# EAGLE design Gamecube3 (EAGLE 6.1)
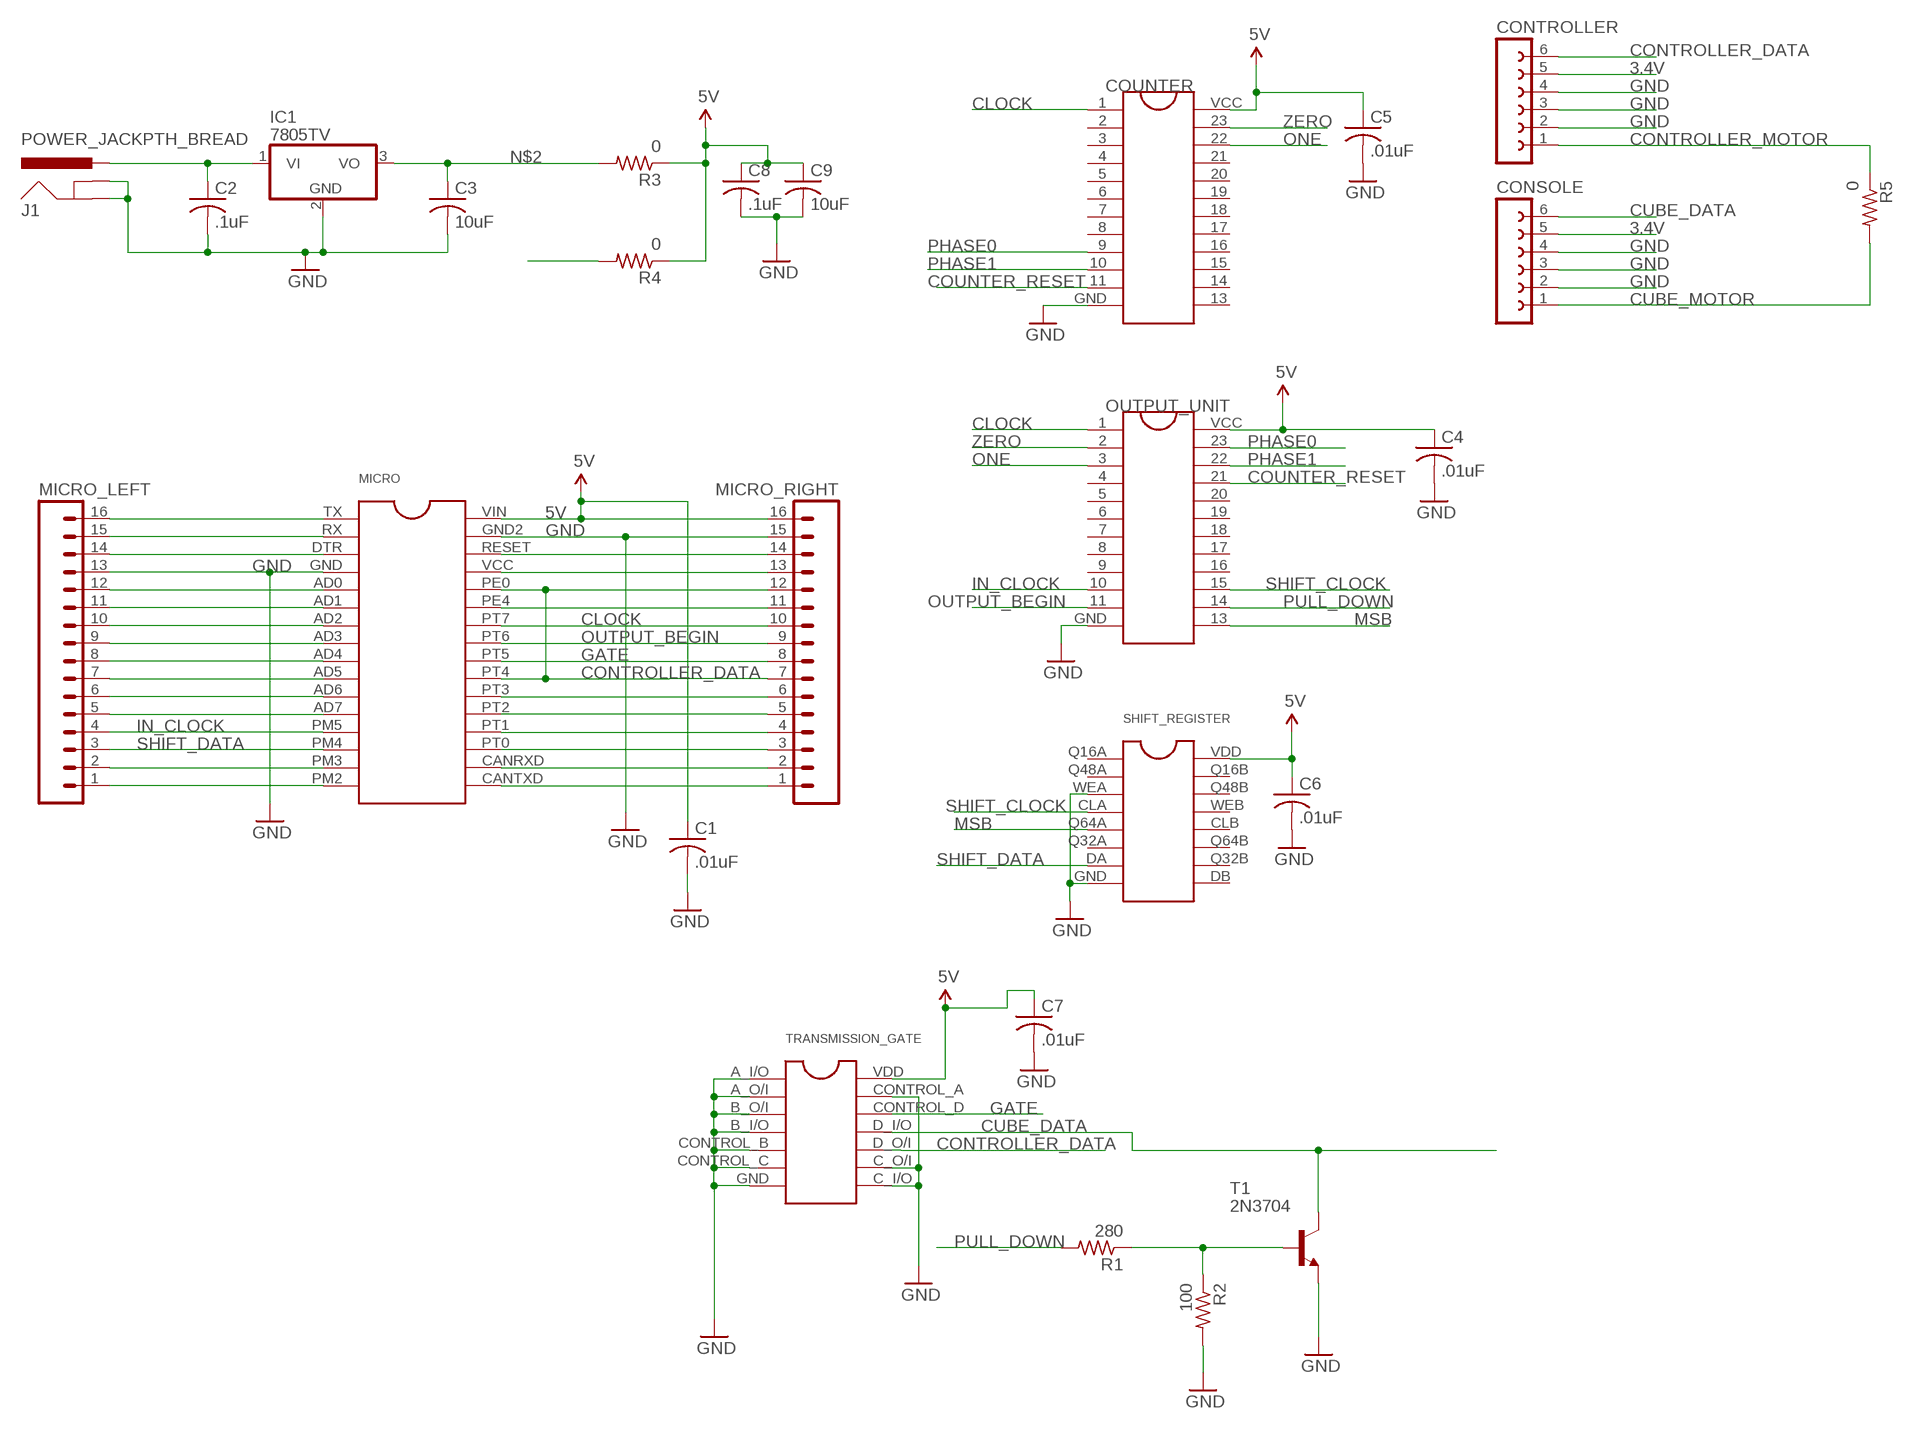
[diagram p0: schematic, sheet 1]

## Parts
C1  .01uF  C-USC0805  [C0805]
C2  .1uF  C-USC0805  [C0805]
C3  10uF  C-USC1206  [C1206]
C4  .01uF  C-USC0805  [C0805]
C5  .01uF  C-USC0805  [C0805]
C6  .01uF  C-USC0805  [C0805]
C7  .01uF  C-USC0805  [C0805]
C8  .1uF  C-USC0805  [C0805]
C9  10uF  C-USC1206  [C1206]
CONSOLE  FE06-1  [FE06]
CONTROLLER  FE06-1  [FE06]
COUNTER  GAL22V10  [24-PIN-DIP]
IC1  7805TV  [TO220V]
J1  POWER_JACKPTH_BREAD  [POWER_JACK_PTH_BREAD]
MICRO  9S12C32  [9S12-32PIN-DIP]
MICRO_LEFT  M16  [16P]
MICRO_RIGHT  M16  [16P]
OUTPUT_UNIT  GAL22V10  [24-PIN-DIP]
R1  280  R-US_0204/7  [0204/7]
R2  100  R-US_0204/7  [0204/7]
R3  0  R-US_0204/7  [0204/7]
R4  0  R-US_0204/7  [0204/7]
R5  0  R-US_0204/7  [0204/7]
SHIFT_REGISTER  CD4517B  [CD4517B]
T1  2N3704  [TO92]
TRANSMISSION_GATE  CD4066B  [CD4066B]

## Nets
3.4V: CONSOLE.5 CONTROLLER.5
5V: C1.1 C4.1 C5.1 C6.1 C7.1 C8.1 C9.1 COUNTER.VCC MICRO.VIN MICRO_RIGHT.16 OUTPUT_UNIT.VCC R3.1 R4.1 SHIFT_REGISTER.VDD TRANSMISSION_GATE.VDD
CLOCK: COUNTER.1 MICRO.PT7 MICRO_RIGHT.10 OUTPUT_UNIT.1
CONTROLLER_DATA: CONTROLLER.6 MICRO.PE0 MICRO.PT4 MICRO_RIGHT.7 MICRO_RIGHT.12 TRANSMISSION_GATE.D_O/I
CONTROLLER_MOTOR: CONTROLLER.1 R5.1
COUNTER_RESET: COUNTER.11 OUTPUT_UNIT.21
CUBE_DATA: CONSOLE.6 T1.2(C) TRANSMISSION_GATE.D_I/O
CUBE_MOTOR: CONSOLE.1 R4.2 R5.2
GATE: MICRO.PT5 MICRO_RIGHT.8 TRANSMISSION_GATE.CONTROL_D
GND: C1.2 C2.2 C3.2 C4.2 C5.2 C6.2 C7.2 C8.2 C9.2 CONSOLE.2 CONSOLE.3 CONSOLE.4 CONTROLLER.2 CONTROLLER.3 CONTROLLER.4 COUNTER.GND IC1.2(GND) J1.GND J1.GNDBREAK MICRO.GND MICRO.GND2 MICRO_LEFT.13 MICRO_RIGHT.15 OUTPUT_UNIT.GND R2.2 SHIFT_REGISTER.GND SHIFT_REGISTER.WEA T1.3(E) TRANSMISSION_GATE.A_I/O TRANSMISSION_GATE.A_O/I TRANSMISSION_GATE.B_I/O TRANSMISSION_GATE.B_O/I TRANSMISSION_GATE.C_I/O TRANSMISSION_GATE.C_O/I TRANSMISSION_GATE.CONTROL_A TRANSMISSION_GATE.CONTROL_B TRANSMISSION_GATE.CONTROL_C TRANSMISSION_GATE.GND
IN_CLOCK: MICRO.PM5 MICRO_LEFT.4 OUTPUT_UNIT.10
MSB: OUTPUT_UNIT.13 SHIFT_REGISTER.Q64A
N$1: C2.1 IC1.1(VI) J1.PWR
N$2: C3.1 IC1.3(VO) R3.2
N$3: R1.1 R2.1 T1.1(B)
N$4: MICRO.CANTXD MICRO_RIGHT.1
N$5: MICRO.PM2 MICRO_LEFT.1
N$6: MICRO.PM3 MICRO_LEFT.2
N$7: MICRO.AD7 MICRO_LEFT.5
N$8: MICRO.AD6 MICRO_LEFT.6
N$9: MICRO.AD5 MICRO_LEFT.7
N$10: MICRO.AD4 MICRO_LEFT.8
N$11: MICRO.AD3 MICRO_LEFT.9
N$12: MICRO.AD2 MICRO_LEFT.10
N$13: MICRO.AD1 MICRO_LEFT.11
N$14: MICRO.AD0 MICRO_LEFT.12
N$15: MICRO.DTR MICRO_LEFT.14
N$16: MICRO.RX MICRO_LEFT.15
N$17: MICRO.TX MICRO_LEFT.16
N$18: MICRO.CANRXD MICRO_RIGHT.2
N$19: MICRO.PT0 MICRO_RIGHT.3
N$20: MICRO.PT1 MICRO_RIGHT.4
N$21: MICRO.PT2 MICRO_RIGHT.5
N$22: MICRO.PT3 MICRO_RIGHT.6
N$23: MICRO.PE4 MICRO_RIGHT.11
N$24: MICRO.VCC MICRO_RIGHT.13
N$25: MICRO.RESET MICRO_RIGHT.14
ONE: COUNTER.22 OUTPUT_UNIT.3
OUTPUT_BEGIN: MICRO.PT6 MICRO_RIGHT.9 OUTPUT_UNIT.11
PHASE0: COUNTER.9 OUTPUT_UNIT.23
PHASE1: COUNTER.10 OUTPUT_UNIT.22
PULL_DOWN: OUTPUT_UNIT.14 R1.2
SHIFT_CLOCK: OUTPUT_UNIT.15 SHIFT_REGISTER.CLA
SHIFT_DATA: MICRO.PM4 MICRO_LEFT.3 SHIFT_REGISTER.DA
ZERO: COUNTER.23 OUTPUT_UNIT.2
Unconnected: COUNTER.2 COUNTER.3 COUNTER.4 COUNTER.5 COUNTER.6 COUNTER.7 COUNTER.8 COUNTER.13 COUNTER.14 COUNTER.15 COUNTER.16 COUNTER.17 COUNTER.18 COUNTER.19 COUNTER.20 COUNTER.21 OUTPUT_UNIT.4 OUTPUT_UNIT.5 OUTPUT_UNIT.6 OUTPUT_UNIT.7 OUTPUT_UNIT.8 OUTPUT_UNIT.9 OUTPUT_UNIT.16 OUTPUT_UNIT.17 OUTPUT_UNIT.18 OUTPUT_UNIT.19 OUTPUT_UNIT.20 SHIFT_REGISTER.CLB SHIFT_REGISTER.DB SHIFT_REGISTER.Q16A SHIFT_REGISTER.Q16B SHIFT_REGISTER.Q32A SHIFT_REGISTER.Q32B SHIFT_REGISTER.Q48A SHIFT_REGISTER.Q48B SHIFT_REGISTER.Q64B SHIFT_REGISTER.WEB

## Library data of the parts
C1-C9 = rcl:C-US: CAPACITOR, American symbol
CONSOLE CONTROLLER = con-lsta:FE06-1: FEMALE HEADER; OC_FARNELL: unknown; OC_NEWARK: unknown
COUNTER OUTPUT_UNIT = GameCube:GAL22V10
IC1 = linear:78*: Positive VOLTAGE REGULATOR Source: http://cache.national.com/ds/LM/LM78L05.pdf http://www.fairchildsemi.com/ds/LM/LM7805.pdf
J1 = SparkFun-Connectors:POWER_JACK: Power Jack This is the standard 5.5mm barrel jack for power. The PTH is the most common, proven, reliable, footprint. The Slot footprint only works if the mill layer is transmitted to the PCB fab house so be warned. Mating wall wart : TOL-00298 (and others); PROD_ID: PRT-10811
MICRO = GameCube:9S12C32
MICRO_LEFT MICRO_RIGHT = con-amp-quick:M16: AMP QUICK CONNECTOR; OC_FARNELL: unknown; OC_NEWARK: unknown
R1-R5 = rcl:R-US_: RESISTOR, American symbol
SHIFT_REGISTER = GameCube:CD4517B
T1 = transistor:2N3704: NPN TRANSISTOR
TRANSMISSION_GATE = GameCube:CD4066B

## Net classes
0 default: width 0.254 mm, clearance 0.254 mm

## Board
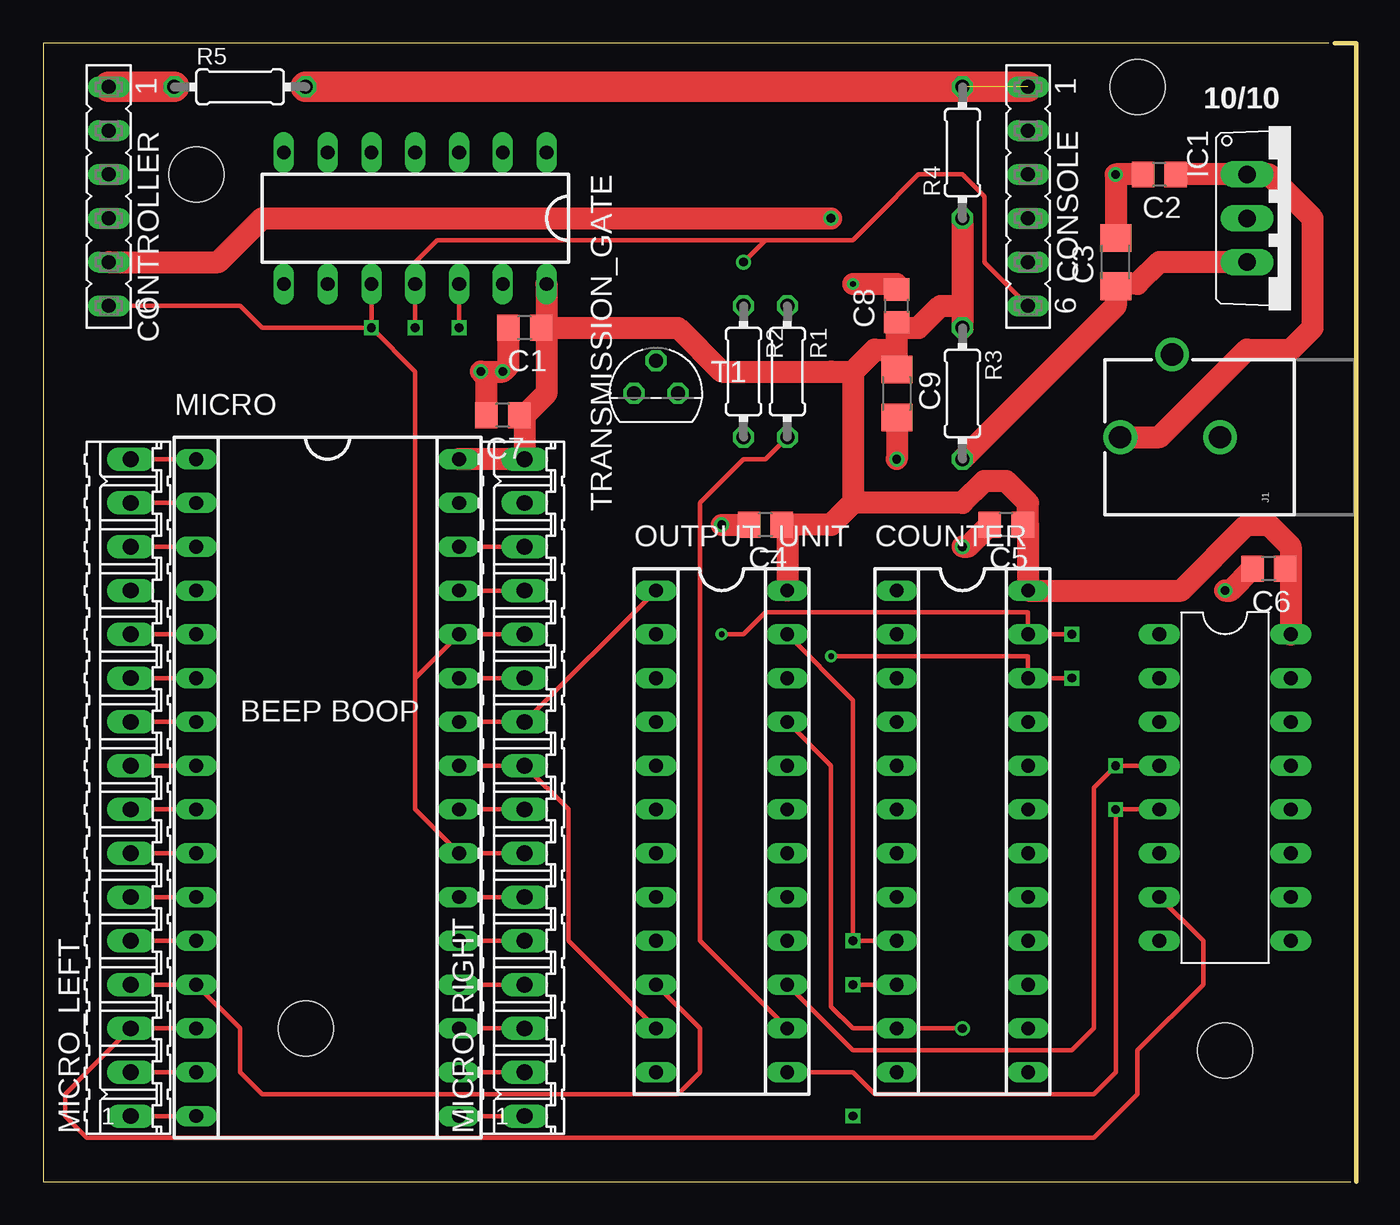
[diagram p1: board, top side]
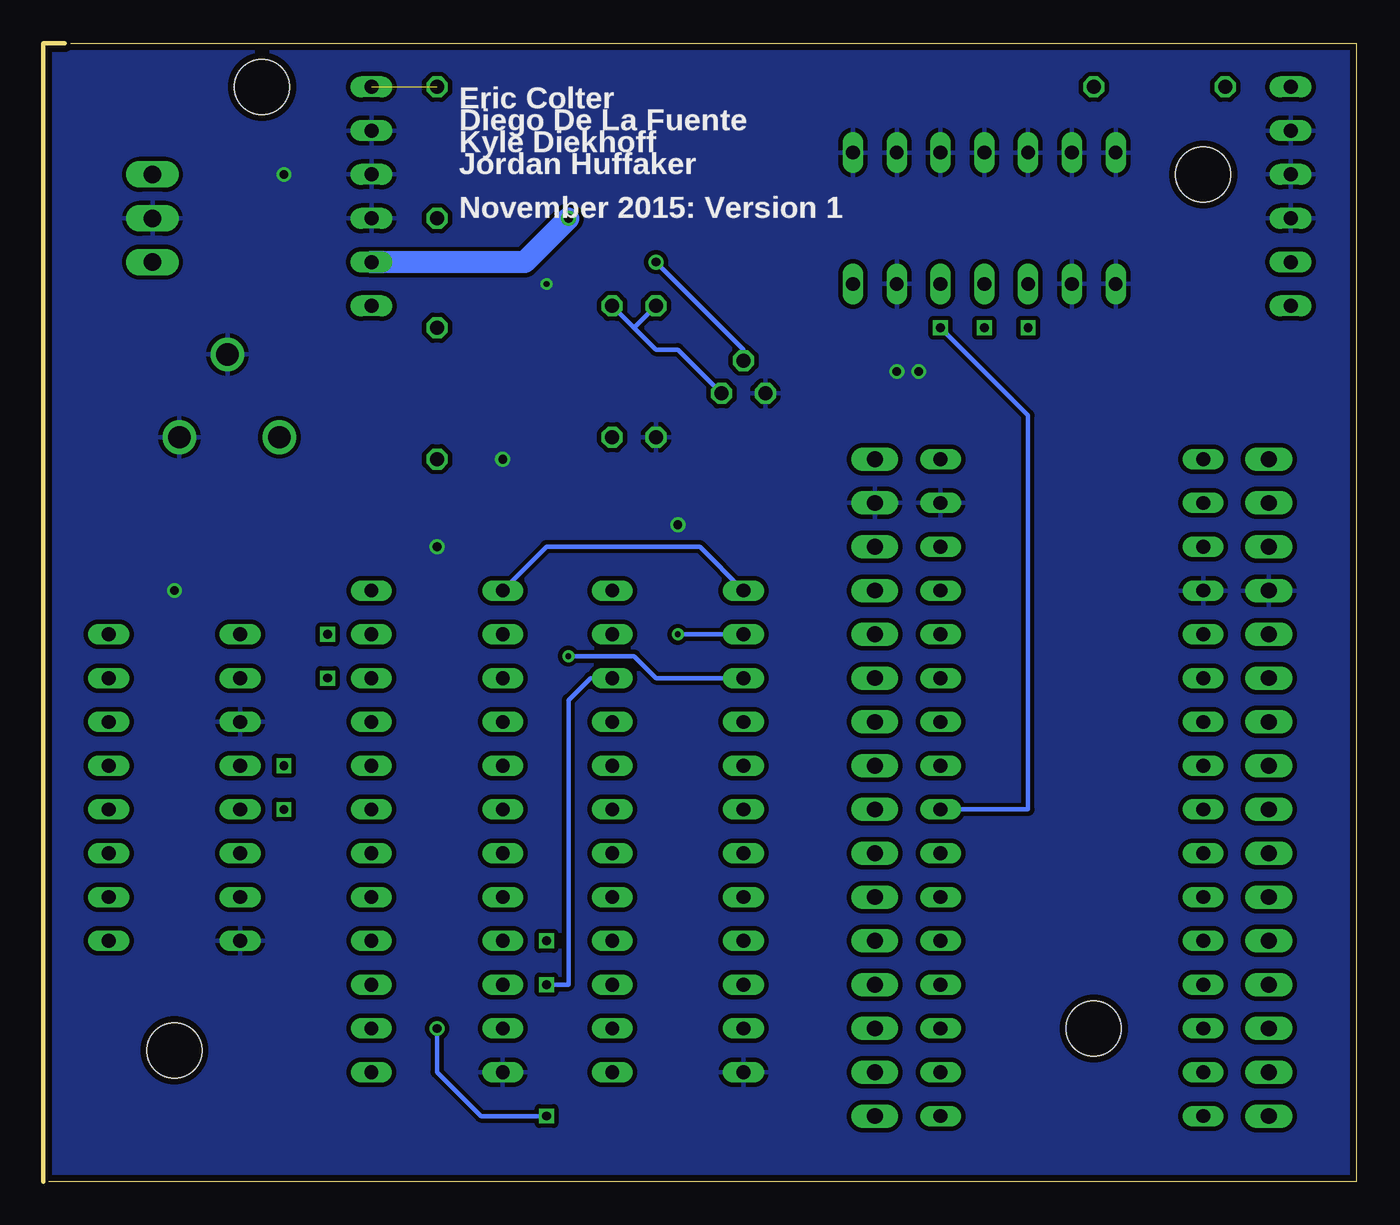
[diagram p2: board, bottom side, seen from below]

Size 76.2 x 66.04 mm. Coordinates in mm from the lower left corner, seen from the top.
Outline: 75.87,0 0,0 0,66.03 74.6,66.03
Outline: 76.2,0 76.2,66.04 74.93,66.04
Copper layers (1*16): Top 0.0356mm / dielectric 1.5011mm / Bottom 0.0356mm
Design rules: minimum track width 6mil, minimum drill 13mil, track to track 6mil, track to pad 6mil, pad to pad 6mil, via to via 6mil, smd to smd 6mil, copper to edge 15mil, drill to drill 6mil, minimum pad ring 7mil, minimum via ring 7mil, stop-mask expansion 3mil, vias tented up to drill 0mil, thermal gap 10mil
Holes 3.17 mm at 8.89,58.42 15.24,8.89 63.5,63.5 68.58,7.62

### Footprints (pad centres in the part's own frame; a part is rotated, then mirrored left to right if it is on the bottom)
C0805 = smd 1.3 x 1.5: 1 -0.95,0; 2 0.95,0
C1206 = smd 1.6 x 1.8: 1 -1.4,0; 2 1.4,0
FE06 = drill 0.813 long: 1 -6.35,0; 2 -3.81,0; 3 -1.27,0; 4 1.27,0; 5 3.81,0; 6 6.35,0
24-PIN-DIP = drill 0.8 long: 1 -3.81,13.97; 2 -3.81,11.43; 3 -3.81,8.89; 4 -3.81,6.35; 5 -3.81,3.81; 6 -3.81,1.27; 7 -3.81,-1.27; 8 -3.81,-3.81; 9 -3.81,-6.35; 10 -3.81,-8.89; 11 -3.81,-11.43; 13 3.81,-13.97; 14 3.81,-11.43; 15 3.81,-8.89; 16 3.81,-6.35; 17 3.81,-3.81; 18 3.81,-1.27; 19 3.81,1.27; 20 3.81,3.81; 21 3.81,6.35; 22 3.81,8.89; 23 3.81,11.43; GND -3.81,-13.97; VCC 3.81,13.97
TO220V = drill 1.016 long: 1 -2.54,-2.54; 2 0,-2.54; 3 2.54,-2.54
POWER_JACK_PTH_BREAD = drill 1.3: GND 0,7.9; GNDBREAK 4.8,10.7; PWR 0,13.7
9S12-32PIN-DIP = drill 0.8 long: AD0 -7.62,1.27; AD1 -7.62,-1.27; AD2 -7.62,-3.81; AD3 -7.62,-6.35; AD4 -7.62,-8.89; AD5 -7.62,-11.43; AD6 -7.62,-13.97; AD7 -7.62,-16.51; CANRXD 7.62,-24.13; CANTXD 7.62,-26.67; DTR -7.62,6.35; GND -7.62,3.81; GND2 7.62,8.89; PE0 7.62,1.27; PE4 7.62,-1.27; PM2 -7.62,-26.67; PM3 -7.62,-24.13; PM4 -7.62,-21.59; PM5 -7.62,-19.05; PT0 7.62,-21.59; PT1 7.62,-19.05; PT2 7.62,-16.51; PT3 7.62,-13.97; PT4 7.62,-11.43; PT5 7.62,-8.89; PT6 7.62,-6.35; PT7 7.62,-3.81; RESET 7.62,6.35; RX -7.62,8.89; TX -7.62,11.43; VCC 7.62,3.81; VIN 7.62,11.43
16P = drill 0.914 long: 1 -19.05,0; 2 -16.51,0; 3 -13.97,0; 4 -11.43,0; 5 -8.89,0; 6 -6.35,0; 7 -3.81,0; 8 -1.27,0; 9 1.27,0; 10 3.81,0; 11 6.35,0; 12 8.89,0; 13 11.43,0; 14 13.97,0; 15 16.51,0; 16 19.05,0
0204/7 = drill 0.813 octagon: 1 -3.81,0; 2 3.81,0
CD4517B = drill 0.8 long: CLA -3.81,2.54; CLB 3.81,0; DA -3.81,-5.08; DB 3.81,-7.62; GND -3.81,-7.62; Q16A -3.81,10.16; Q16B 3.81,7.62; Q32A -3.81,-2.54; Q32B 3.81,-5.08; Q48A -3.81,7.62; Q48B 3.81,5.08; Q64A -3.81,0; Q64B 3.81,-2.54; VDD 3.81,10.16; WEA -3.81,5.08; WEB 3.81,2.54
TO92 = drill 0.813 octagon: 1 1.27,0; 2 0,1.905; 3 -1.27,0
CD4066B = drill 0.8 long: A_I/O -3.81,7.62; A_O/I -3.81,5.08; B_I/O -3.81,0; B_O/I -3.81,2.54; C_I/O 3.81,-7.62; C_O/I 3.81,-5.08; CONTROL_A 3.81,5.08; CONTROL_B -3.81,-2.54; CONTROL_C -3.81,-5.08; CONTROL_D 3.81,2.54; D_I/O 3.81,0; D_O/I 3.81,-2.54; GND -3.81,-7.62; VDD 3.81,7.62

### Placement (x,y rotation side)
C1  27.94,49.53 180 top
C2  64.77,58.42 180 top
C3  62.23,53.34 90 top
C4  41.91,38.1 180 top
C5  55.88,38.1 180 top
C6  71.12,35.56 180 top
C7  26.67,44.45 180 top
C8  49.53,50.8 90 top
C9  49.53,45.72 270 top
CONSOLE  57.15,57.15 270 top
CONTROLLER  3.81,57.15 270 top
COUNTER  53.34,20.32 0 top
IC1  72.39,55.88 270 top
J1  76.2,43.18 90 top
MICRO  16.51,30.48 0 top
MICRO_LEFT  5.08,22.86 90 top
MICRO_RIGHT  27.94,22.86 90 top
OUTPUT_UNIT  39.37,20.32 0 top
R1  43.18,46.99 270 top
R2  40.64,46.99 270 top
R3  53.34,45.72 270 top
R4  53.34,59.69 90 top
R5  11.43,63.5 0 top
SHIFT_REGISTER  68.58,21.59 0 top
T1  35.56,45.72 0 top
TRANSMISSION_GATE  21.59,55.88 270 top

### Tracks (layer width: path | path; a pad name or v marks a point on that pad's centre or on a via)
3.4V  (via drill 0.51)
  Top 1.27: CONTROLLER.5 10.16,53.34 12.7,55.88 v45.72,55.88
  Bottom 1.27: v45.72,55.88 48.26,53.34 CONSOLE.5
5V
  Top 0.254: 27.94,44.45 C7.1 | 43.18,38.1 C4.1 | 29.21,49.53 C1.1 | 57.15,38.1 C5.1 | 49.53,49.53 C8.1 | 72.39,35.56 C6.1 | 49.53,46.99 C9.1
  Top 1.27: R4.1 53.34,50.8 | 53.34,50.8 R3.1 | 49.53,46.99 C9.1 49.53,48.26 | 49.53,48.26 49.53,49.53 50.8,49.53 52.07,50.8 53.34,50.8 | TRANSMISSION_GATE.VDD 29.21,49.53 | 29.21,49.53 29.21,45.72 27.94,44.45 MICRO_RIGHT.16 MICRO.VIN | 29.21,49.53 36.83,49.53 39.37,46.99 45.72,46.99 46.99,46.99 | 46.99,46.99 48.26,48.26 49.53,48.26 | 46.99,46.99 46.99,39.37 | 46.99,39.37 45.72,38.1 43.18,38.1 OUTPUT_UNIT.VCC | 46.99,39.37 53.34,39.37 54.61,40.64 55.88,40.64 57.15,39.37 57.15,38.1 COUNTER.VCC 66.04,34.29 69.85,38.1 71.12,38.1 72.39,36.83 72.39,35.56 SHIFT_REGISTER.VDD
CLOCK
  Top 0.254: MICRO.PT7 MICRO_RIGHT.10 OUTPUT_UNIT.1
  Bottom 0.254: COUNTER.1 46.99,36.83 38.1,36.83 OUTPUT_UNIT.1
CONTROLLER_DATA  (via drill 0.51)
  Top 0.254: CONTROLLER.6 11.43,50.8 12.7,49.53 v19.05,49.53 | v19.05,49.53 TRANSMISSION_GATE.D_O/I | MICRO_RIGHT.7 MICRO.PT4 21.59,21.59 21.59,29.21 | MICRO_RIGHT.12 MICRO.PE0 21.59,29.21 | v19.05,49.53 21.59,46.99 21.59,29.21
CONTROLLER_MOTOR
  Top 1.778: R5.1 CONTROLLER.1
COUNTER_RESET  (via drill 0.51)
  Top 0.254: OUTPUT_UNIT.21 45.72,24.13 45.72,10.16 46.99,8.89 COUNTER.11 v53.34,8.89
  Bottom 0.254: v53.34,8.89 53.34,6.35 50.8,3.81 v46.99,3.81
CUBE_DATA  (via drill 0.51)
  Top 0.254: v21.59,49.53 TRANSMISSION_GATE.D_I/O 21.59,53.34 22.86,54.61 46.99,54.61 | CONSOLE.6 54.61,53.34 54.61,57.15 53.34,58.42 50.8,58.42 48.26,55.88 46.99,54.61 | 46.99,54.61 41.91,54.61 v40.64,53.34
  Bottom 0.254: T1.2 35.56,48.26 v40.64,53.34
CUBE_MOTOR  (1 unrouted)
  Top 1.778: CONSOLE.1 R5.2
GATE  (via drill 0.51)
  Top 0.254: TRANSMISSION_GATE.CONTROL_D v24.13,49.53 | MICRO_RIGHT.8 MICRO.PT5
  Bottom 0.254: v24.13,49.53 19.05,44.45 19.05,21.59 MICRO.PT5
GND  (via drill 0.33, 0.51)
  Top 0.254: 49.53,52.07 C8.2 | 49.53,44.45 C9.2 | 62.23,54.61 C3.2
  Top 1.27: C1.2 26.99,47.31 v26.67,46.99 v25.4,46.99 25.72,46.67 C7.2 | v39.37,38.1 C4.2 | v53.34,36.83 53.66,36.83 C5.2 | v68.58,34.29 68.9,34.29 C6.2 | C2.2 v62.23,58.42 C3.2 | v46.99,52.07 49.53,52.07 | 49.53,44.45 v49.53,41.91
  pour Bottom: 0,66.04 0,0 76.2,0 76.2,66.04
IN_CLOCK
  Top 0.254: MICRO_LEFT.4 MICRO.PM5 11.43,8.89 11.43,6.35 12.7,5.08 36.83,5.08 38.1,6.35 38.1,8.89 OUTPUT_UNIT.10
MSB  (via drill 0.51)
  Top 0.254: SHIFT_REGISTER.Q64A v62.23,21.59 62.23,6.35 60.96,5.08 48.26,5.08 46.99,6.35 OUTPUT_UNIT.13
N$1
  Top 0.254: 66.04,58.42 C2.1
  Top 1.27: J1.PWR 64.77,43.18 69.85,48.26 72.39,48.26 73.66,49.53 73.66,55.88 71.12,58.42 IC1.1 66.04,58.42
N$2
  Top 1.27: IC1.3 66.04,53.34 64.77,53.34 63.5,52.07 62.36,52.07 C3.1 62.23,50.8 R3.2
N$3
  Bottom 0.254: T1.1 39.37,48.26 40.64,48.26 41.91,49.53 | R1.1 41.91,49.53 | 41.91,49.53 R2.1
N$4
  Top 0.254: MICRO_RIGHT.1 MICRO.CANTXD
N$5
  Top 0.254: MICRO_LEFT.1 MICRO.PM2
N$6
  Top 0.254: MICRO_LEFT.2 MICRO.PM3
N$7
  Top 0.254: MICRO_LEFT.5 MICRO.AD7
N$8
  Top 0.254: MICRO_LEFT.6 MICRO.AD6
N$9
  Top 0.254: MICRO_LEFT.7 MICRO.AD5
N$10
  Top 0.254: MICRO_LEFT.8 MICRO.AD4
N$11
  Top 0.254: MICRO_LEFT.9 MICRO.AD3
N$12
  Top 0.254: MICRO_LEFT.10 MICRO.AD2
N$13
  Top 0.254: MICRO_LEFT.11 MICRO.AD1
N$14
  Top 0.254: MICRO_LEFT.12 MICRO.AD0
N$15
  Top 0.254: MICRO_LEFT.14 MICRO.DTR
N$16
  Top 0.254: MICRO_LEFT.15 MICRO.RX
N$17
  Top 0.254: MICRO_LEFT.16 MICRO.TX
N$18
  Top 0.254: MICRO_RIGHT.2 MICRO.CANRXD
N$19
  Top 0.254: MICRO_RIGHT.3 MICRO.PT0
N$20
  Top 0.254: MICRO_RIGHT.4 MICRO.PT1
N$21
  Top 0.254: MICRO_RIGHT.5 MICRO.PT2
N$22
  Top 0.254: MICRO_RIGHT.6 MICRO.PT3
N$23
  Top 0.254: MICRO_RIGHT.11 MICRO.PE4
N$24
  Top 0.254: MICRO_RIGHT.13 MICRO.VCC
N$25
  Top 0.254: MICRO_RIGHT.14 MICRO.RESET
ONE  (via drill 0.33, 0.51)
  Top 0.254: v59.69,29.21 COUNTER.22 57.15,30.48 v45.72,30.48
  Bottom 0.254: OUTPUT_UNIT.3 40.64,29.21 41.91,30.48 v45.72,30.48
OUTPUT_BEGIN
  Top 0.254: OUTPUT_UNIT.11 30.48,13.97 30.48,21.59 MICRO_RIGHT.9 MICRO.PT6
PHASE0  (via drill 0.51)
  Top 0.254: COUNTER.9 v46.99,13.97 46.99,27.94 OUTPUT_UNIT.23
PHASE1  (via drill 0.51)
  Top 0.254: COUNTER.10 v46.99,11.43
  Bottom 0.254: OUTPUT_UNIT.22 44.45,29.21 45.72,27.94 45.72,11.43 v46.99,11.43
PULL_DOWN
  Top 0.254: OUTPUT_UNIT.14 38.1,13.97 38.1,39.37 40.64,41.91 41.91,41.91 R1.2
SHIFT_CLOCK  (via drill 0.51)
  Top 0.254: SHIFT_REGISTER.CLA v62.23,24.13 60.96,22.86 60.96,8.89 59.69,7.62 46.99,7.62 45.72,8.89 OUTPUT_UNIT.15
SHIFT_DATA
  Top 0.254: MICRO.PM4 MICRO_LEFT.3 2.54,6.35 1.27,5.08 1.27,3.81 2.54,2.54 60.96,2.54 63.5,5.08 63.5,7.62 67.31,11.43 67.31,13.97 SHIFT_REGISTER.DA
ZERO  (via drill 0.33, 0.51)
  Top 0.254: v59.69,31.75 COUNTER.23 57.15,33.02 41.91,33.02 40.64,31.75 v39.37,31.75
  Bottom 0.254: v39.37,31.75 OUTPUT_UNIT.2

### Text on the board
tPlace: 10/10
bPlace: Eric Colter | Diego De La Fuente | Kyle Diekhoff | Jordan Huffaker | November 2015: Version 1